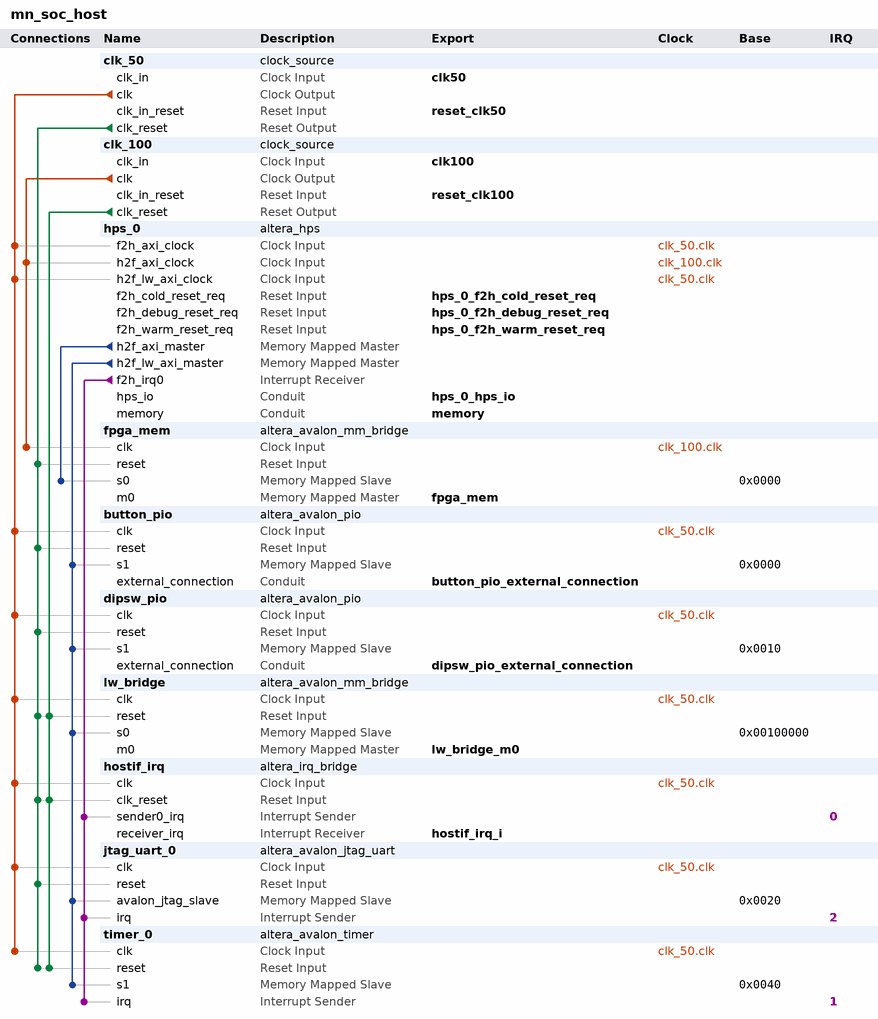
[diagram p0: system contents]
# Platform Designer (Qsys) system mn_soc_host, Cyclone V 5CSXFC6D6F31C6
# Parameters at their usual value, and those the tool derives, are not listed.
package require -exact qsys 14.0
create_system mn_soc_host
set_project_property DEVICE_FAMILY {Cyclone V}
set_project_property DEVICE 5CSXFC6D6F31C6

add_instance clk_50 clock_source 14.0
set_instance_parameter_value clk_50 clockFrequency 50000000

add_instance clk_100 clock_source 14.0
set_instance_parameter_value clk_100 clockFrequency 100000000

add_instance hps_0 altera_hps 14.0
set_instance_parameter_value hps_0 MEM_VENDOR JEDEC
set_instance_parameter_value hps_0 MEM_ROW_ADDR_WIDTH 15
set_instance_parameter_value hps_0 MEM_COL_ADDR_WIDTH 10
set_instance_parameter_value hps_0 MEM_DQ_WIDTH 40
set_instance_parameter_value hps_0 MEM_BANKADDR_WIDTH 3
set_instance_parameter_value hps_0 MEM_DRV_STR RZQ/6
set_instance_parameter_value hps_0 MEM_RTT_NOM RZQ/6
set_instance_parameter_value hps_0 MEM_RTT_WR {Dynamic ODT off}
set_instance_parameter_value hps_0 MEM_WTCL 6
set_instance_parameter_value hps_0 MEM_TCL 7
set_instance_parameter_value hps_0 TIMING_TIS 170
set_instance_parameter_value hps_0 TIMING_TIH 120
set_instance_parameter_value hps_0 TIMING_TDS 10
set_instance_parameter_value hps_0 TIMING_TDH 45
set_instance_parameter_value hps_0 TIMING_TDQSQ 100
set_instance_parameter_value hps_0 TIMING_TDQSCK 225
set_instance_parameter_value hps_0 TIMING_TDQSS 0.27
set_instance_parameter_value hps_0 TIMING_TQSH 0.4
set_instance_parameter_value hps_0 TIMING_TDSH 0.18
set_instance_parameter_value hps_0 TIMING_TDSS 0.18
set_instance_parameter_value hps_0 MEM_TRAS_NS 35.0
set_instance_parameter_value hps_0 MEM_TRCD_NS 13.75
set_instance_parameter_value hps_0 MEM_TRP_NS 13.75
set_instance_parameter_value hps_0 MEM_TRFC_NS 260.0
set_instance_parameter_value hps_0 MEM_TFAW_NS 30.0
set_instance_parameter_value hps_0 MEM_TRRD_NS 10.0
set_instance_parameter_value hps_0 MEM_TRTP_NS 10.0
set_instance_parameter_value hps_0 REF_CLK_FREQ 25.0
set_instance_parameter_value hps_0 TIMING_BOARD_MAX_CK_DELAY 0.6
set_instance_parameter_value hps_0 TIMING_BOARD_MAX_DQS_DELAY 0.6
set_instance_parameter_value hps_0 TIMING_BOARD_SKEW_CKDQS_DIMM_MIN -0.01
set_instance_parameter_value hps_0 TIMING_BOARD_SKEW_CKDQS_DIMM_MAX 0.01
set_instance_parameter_value hps_0 TIMING_BOARD_SKEW_WITHIN_DQS 0.02
set_instance_parameter_value hps_0 TIMING_BOARD_SKEW_BETWEEN_DQS 0.02
set_instance_parameter_value hps_0 TIMING_BOARD_DQ_TO_DQS_SKEW 0.0
set_instance_parameter_value hps_0 TIMING_BOARD_AC_SKEW 0.02
set_instance_parameter_value hps_0 TIMING_BOARD_AC_TO_CK_SKEW 0.0
set_instance_parameter_value hps_0 MEM_CLK_FREQ 400.0
set_instance_parameter_value hps_0 HPS_PROTOCOL DDR3
set_instance_parameter_value hps_0 desired_cfg_clk_mhz 100.0
set_instance_parameter_value hps_0 desired_qspi_clk_mhz 400.0
set_instance_parameter_value hps_0 STM_Enable false
set_instance_parameter_value hps_0 F2S_Width 2
set_instance_parameter_value hps_0 S2F_Width 1
set_instance_parameter_value hps_0 LWH2F_Enable true
set_instance_parameter_value hps_0 F2SCLK_DBGRST_Enable true
set_instance_parameter_value hps_0 F2SCLK_WARMRST_Enable true
set_instance_parameter_value hps_0 F2SCLK_COLDRST_Enable true
set_instance_parameter_value hps_0 F2SINTERRUPT_Enable true
set_instance_parameter_value hps_0 EMAC1_PinMuxing {HPS I/O Set 0}
set_instance_parameter_value hps_0 EMAC1_Mode RGMII
set_instance_parameter_value hps_0 QSPI_PinMuxing {HPS I/O Set 0}
set_instance_parameter_value hps_0 QSPI_Mode {1 SS}
set_instance_parameter_value hps_0 SDIO_PinMuxing {HPS I/O Set 0}
set_instance_parameter_value hps_0 SDIO_Mode {4-bit Data}
set_instance_parameter_value hps_0 USB1_PinMuxing {HPS I/O Set 0}
set_instance_parameter_value hps_0 USB1_Mode SDR
set_instance_parameter_value hps_0 SPIM0_PinMuxing {HPS I/O Set 0}
set_instance_parameter_value hps_0 SPIM0_Mode {Single Slave Select}
set_instance_parameter_value hps_0 SPIM1_PinMuxing Unused
set_instance_parameter_value hps_0 SPIM1_Mode N/A
set_instance_parameter_value hps_0 UART0_PinMuxing {HPS I/O Set 2}
set_instance_parameter_value hps_0 UART0_Mode {No Flow Control}
set_instance_parameter_value hps_0 I2C0_PinMuxing {HPS I/O Set 1}
set_instance_parameter_value hps_0 I2C0_Mode I2C
set_instance_parameter_value hps_0 I2C1_PinMuxing Unused
set_instance_parameter_value hps_0 I2C1_Mode N/A
set_instance_parameter_value hps_0 CAN0_PinMuxing {HPS I/O Set 0}
set_instance_parameter_value hps_0 CAN0_Mode CAN
set_instance_parameter_value hps_0 TRACE_PinMuxing {HPS I/O Set 0}
set_instance_parameter_value hps_0 TRACE_Mode HPS
set_instance_parameter_value hps_0 FPGA_PERIPHERAL_OUTPUT_CLOCK_FREQ_EMAC0_MD_CLK 100
set_instance_parameter_value hps_0 FPGA_PERIPHERAL_OUTPUT_CLOCK_FREQ_EMAC0_GTX_CLK 100
set_instance_parameter_value hps_0 FPGA_PERIPHERAL_OUTPUT_CLOCK_FREQ_EMAC1_MD_CLK 100
set_instance_parameter_value hps_0 FPGA_PERIPHERAL_OUTPUT_CLOCK_FREQ_EMAC1_GTX_CLK 100

add_instance fpga_mem altera_avalon_mm_bridge 14.0
set_instance_parameter_value fpga_mem DATA_WIDTH 32
set_instance_parameter_value fpga_mem ADDRESS_WIDTH 27
set_instance_parameter_value fpga_mem USE_AUTO_ADDRESS_WIDTH 0
set_instance_parameter_value fpga_mem ADDRESS_UNITS SYMBOLS
set_instance_parameter_value fpga_mem MAX_PENDING_RESPONSES 1

add_instance button_pio altera_avalon_pio 14.0
set_instance_parameter_value button_pio bitClearingEdgeCapReg true
set_instance_parameter_value button_pio captureEdge true
set_instance_parameter_value button_pio direction Input
set_instance_parameter_value button_pio edgeType FALLING
set_instance_parameter_value button_pio irqType EDGE
set_instance_parameter_value button_pio width 2

add_instance dipsw_pio altera_avalon_pio 14.0
set_instance_parameter_value dipsw_pio bitClearingEdgeCapReg true
set_instance_parameter_value dipsw_pio captureEdge true
set_instance_parameter_value dipsw_pio direction Input
set_instance_parameter_value dipsw_pio edgeType ANY
set_instance_parameter_value dipsw_pio irqType EDGE
set_instance_parameter_value dipsw_pio width 4

add_instance lw_bridge altera_avalon_mm_bridge 14.0
set_instance_parameter_value lw_bridge DATA_WIDTH 32
set_instance_parameter_value lw_bridge ADDRESS_WIDTH 18
set_instance_parameter_value lw_bridge USE_AUTO_ADDRESS_WIDTH 0
set_instance_parameter_value lw_bridge ADDRESS_UNITS SYMBOLS
set_instance_parameter_value lw_bridge MAX_PENDING_RESPONSES 4

add_instance hostif_irq altera_irq_bridge 14.0
set_instance_parameter_value hostif_irq IRQ_WIDTH 1

add_instance jtag_uart_0 altera_avalon_jtag_uart 14.0
set_instance_parameter_value jtag_uart_0 simInteractiveOptions NO_INTERACTIVE_WINDOWS

add_instance timer_0 altera_avalon_timer 14.0
set_instance_parameter_value timer_0 alwaysRun true
set_instance_parameter_value timer_0 fixedPeriod true
set_instance_parameter_value timer_0 period 1
set_instance_parameter_value timer_0 periodUnits MSEC
set_instance_parameter_value timer_0 snapshot false

# connections
add_connection clk_50.clk button_pio.clk clock
add_connection clk_50.clk dipsw_pio.clk clock
add_connection clk_50.clk hostif_irq.clk clock
add_connection clk_50.clk hps_0.f2h_axi_clock clock
add_connection clk_50.clk hps_0.h2f_lw_axi_clock clock
add_connection clk_50.clk jtag_uart_0.clk clock
add_connection clk_50.clk lw_bridge.clk clock
add_connection clk_50.clk timer_0.clk clock
add_connection clk_100.clk fpga_mem.clk clock
add_connection clk_100.clk hps_0.h2f_axi_clock clock
add_connection clk_50.clk_reset button_pio.reset reset
add_connection clk_50.clk_reset dipsw_pio.reset reset
add_connection clk_50.clk_reset fpga_mem.reset reset
add_connection clk_50.clk_reset hostif_irq.clk_reset reset
add_connection clk_50.clk_reset jtag_uart_0.reset reset
add_connection clk_50.clk_reset lw_bridge.reset reset
add_connection clk_50.clk_reset timer_0.reset reset
add_connection clk_100.clk_reset hostif_irq.clk_reset reset
add_connection clk_100.clk_reset lw_bridge.reset reset
add_connection clk_100.clk_reset timer_0.reset reset
add_connection hps_0.h2f_axi_master fpga_mem.s0 avalon
set_connection_parameter_value hps_0.h2f_axi_master/fpga_mem.s0 baseAddress 0x0000
add_connection hps_0.h2f_lw_axi_master button_pio.s1 avalon
set_connection_parameter_value hps_0.h2f_lw_axi_master/button_pio.s1 baseAddress 0x0000
add_connection hps_0.h2f_lw_axi_master dipsw_pio.s1 avalon
set_connection_parameter_value hps_0.h2f_lw_axi_master/dipsw_pio.s1 baseAddress 0x0010
add_connection hps_0.h2f_lw_axi_master jtag_uart_0.avalon_jtag_slave avalon
set_connection_parameter_value hps_0.h2f_lw_axi_master/jtag_uart_0.avalon_jtag_slave baseAddress 0x0020
add_connection hps_0.h2f_lw_axi_master lw_bridge.s0 avalon
set_connection_parameter_value hps_0.h2f_lw_axi_master/lw_bridge.s0 baseAddress 0x00100000
add_connection hps_0.h2f_lw_axi_master timer_0.s1 avalon
set_connection_parameter_value hps_0.h2f_lw_axi_master/timer_0.s1 baseAddress 0x0040
add_connection hps_0.f2h_irq0 hostif_irq.sender0_irq interrupt
set_connection_parameter_value hps_0.f2h_irq0/hostif_irq.sender0_irq irqNumber 0
add_connection hps_0.f2h_irq0 jtag_uart_0.irq interrupt
set_connection_parameter_value hps_0.f2h_irq0/jtag_uart_0.irq irqNumber 2
add_connection hps_0.f2h_irq0 timer_0.irq interrupt
set_connection_parameter_value hps_0.f2h_irq0/timer_0.irq irqNumber 1

# exported interfaces
add_interface memory conduit end
set_interface_property memory EXPORT_OF hps_0.memory
add_interface clk50 clock sink
set_interface_property clk50 EXPORT_OF clk_50.clk_in
add_interface reset_clk50 reset sink
set_interface_property reset_clk50 EXPORT_OF clk_50.clk_in_reset
add_interface hps_0_hps_io conduit end
set_interface_property hps_0_hps_io EXPORT_OF hps_0.hps_io
add_interface dipsw_pio_external_connection conduit end
set_interface_property dipsw_pio_external_connection EXPORT_OF dipsw_pio.external_connection
add_interface button_pio_external_connection conduit end
set_interface_property button_pio_external_connection EXPORT_OF button_pio.external_connection
add_interface hps_0_f2h_cold_reset_req reset sink
set_interface_property hps_0_f2h_cold_reset_req EXPORT_OF hps_0.f2h_cold_reset_req
add_interface hps_0_f2h_debug_reset_req reset sink
set_interface_property hps_0_f2h_debug_reset_req EXPORT_OF hps_0.f2h_debug_reset_req
add_interface hps_0_f2h_warm_reset_req reset sink
set_interface_property hps_0_f2h_warm_reset_req EXPORT_OF hps_0.f2h_warm_reset_req
add_interface clk100 clock sink
set_interface_property clk100 EXPORT_OF clk_100.clk_in
add_interface fpga_mem avalon master
set_interface_property fpga_mem EXPORT_OF fpga_mem.m0
add_interface reset_clk100 reset sink
set_interface_property reset_clk100 EXPORT_OF clk_100.clk_in_reset
add_interface hostif_irq_i interrupt receiver
set_interface_property hostif_irq_i EXPORT_OF hostif_irq.receiver_irq
add_interface lw_bridge_m0 avalon master
set_interface_property lw_bridge_m0 EXPORT_OF lw_bridge.m0

set_interconnect_requirement {$system} qsys_mm.clockCrossingAdapter HANDSHAKE
set_interconnect_requirement {$system} qsys_mm.maxAdditionalLatency 1
set_interconnect_requirement {$system} qsys_mm.insertDefaultSlave false

save_system mn_soc_host.qsys
